# EAGLE design Dyno MCN Breakout (EAGLE 5.12)
PARTNO: 55959-2030
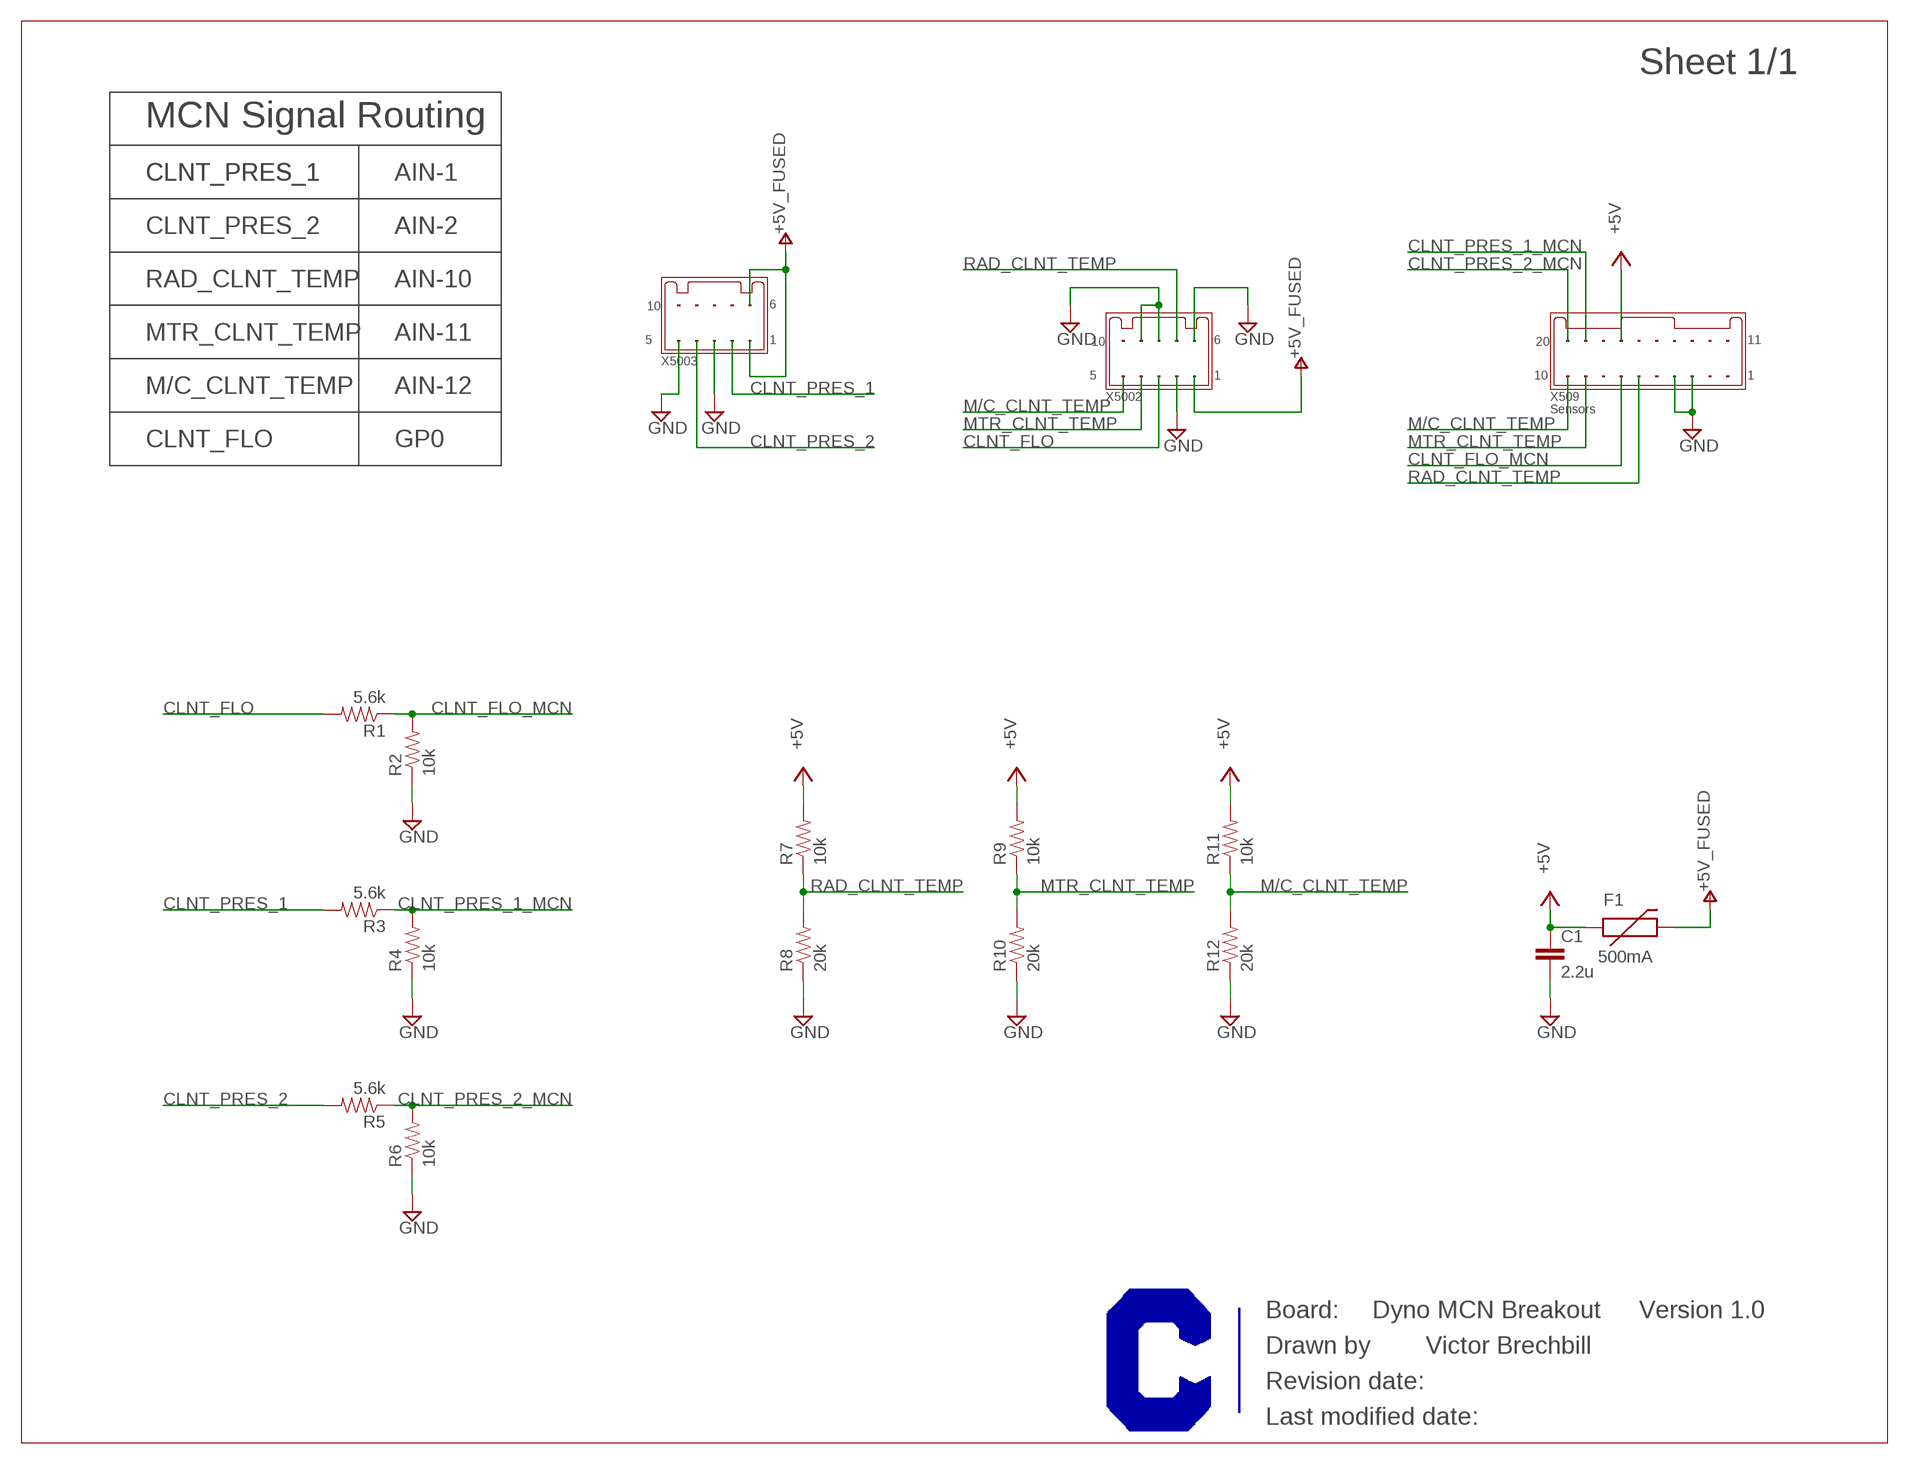
[diagram p0: schematic, sheet 1]

## Parts
C1  2.2u  CAP0603-CAP  [0603-CAP]
F1  500mA  PTC0603  [0603]
R1  5.6k  RESISTOR0603-RES  [0603-RES]
R2  10k  RESISTOR0603-RES  [0603-RES]
R3  5.6k  RESISTOR0603-RES  [0603-RES]
R4  10k  RESISTOR0603-RES  [0603-RES]
R5  5.6k  RESISTOR0603-RES  [0603-RES]
R6  10k  RESISTOR0603-RES  [0603-RES]
R7  10k  RESISTOR0603-RES  [0603-RES]
R8  20k  RESISTOR0603-RES  [0603-RES]
R9  10k  RESISTOR0603-RES  [0603-RES]
R10  20k  RESISTOR0603-RES  [0603-RES]
R11  10k  RESISTOR0603-RES  [0603-RES]
R12  20k  RESISTOR0603-RES  [0603-RES]
U$1  CURRENT-C-LETTER-LANDSCAPE  [BLANK]
X509  Sensors  MICROCLASP-20-DUAL-RA  [MICROCLASP-20-DUAL-RA]
X5002  MICROCLASP-10-DUAL  [MICROCLASP-10-DUAL-RA]
X5003  MICROCLASP-10-DUAL  [MICROCLASP-10-DUAL-RA]

## Nets
+5V: C1.1 F1.1 R7.2 R9.2 R11.2 X509.17
+5V_FUSED: F1.2 X5002.1 X5003.1 X5003.6 ; supply symbol labelled V+
CLNT_FLO: R1.2 X5002.3
CLNT_FLO_MCN: R1.1 R2.2 X509.7
CLNT_PRES_1: R3.2 X5003.2
CLNT_PRES_1_MCN: R3.1 R4.2 X509.19
CLNT_PRES_2: R5.2 X5003.4
CLNT_PRES_2_MCN: R5.1 R6.2 X509.20
GND: C1.2 R2.1 R4.1 R6.1 R8.1 R10.1 R12.1 X509.3 X509.4 X5002.2 X5002.6 X5002.8 X5002.9 X5003.3 X5003.5
M/C_CLNT_TEMP: R11.1 R12.2 X509.10 X5002.5
MTR_CLNT_TEMP: R9.1 R10.2 X509.9 X5002.4
RAD_CLNT_TEMP: R7.1 R8.2 X509.6 X5002.7
Unconnected: X509.1 X509.2 X509.5 X509.8 X509.11 X509.12 X509.13 X509.14 X509.15 X509.16 X509.18 X5002.10 X5003.7 X5003.8 X5003.9 X5003.10

## Notes on the sheet
- MCN Signal Routing
- CLNT_PRES_1 | CLNT_PRES_1 | AIN-1
- CLNT_PRES_2 | AIN-2 | +5V_FUSED
- RAD_CLNT_TEMP | AIN-10
- MTR_CLNT_TEMP | AIN-11
- +5V_FUSED
- M/C_CLNT_TEMP | AIN-12
- CLNT_FLO | GP0
- +5V_FUSED
- Dyno MCN Breakout | Version 1.0
- Victor Brechbill

## Library data of the parts
C1 = SparkFun:CAP: Capacitor Standard 0603 ceramic capacitor, and 0.1" leaded capacitor.
F1 = SparkFun:PTC: Resettable Fuse PTC Resettable Fuse. Spark Fun Electronics SKU : COM-08357
R1-R12 = SparkFun:RESISTOR: Resistor Basic schematic elements and footprints for 0603, 1206, and PTH resistors.
U$1 = Frames:CURRENT-C-LETTER-LANDSCAPE; BOM: EXCLUDE
X509 = Molex:MICROCLASP-20-DUAL
X5002 X5003 = Molex:MICROCLASP-10-DUAL: Microclasp 10 crkt Header Datasheet <http://www.molex.com/pdm_docs/sd/559591030_sd.pdf>; PARTNO: 55959-1030

## Board
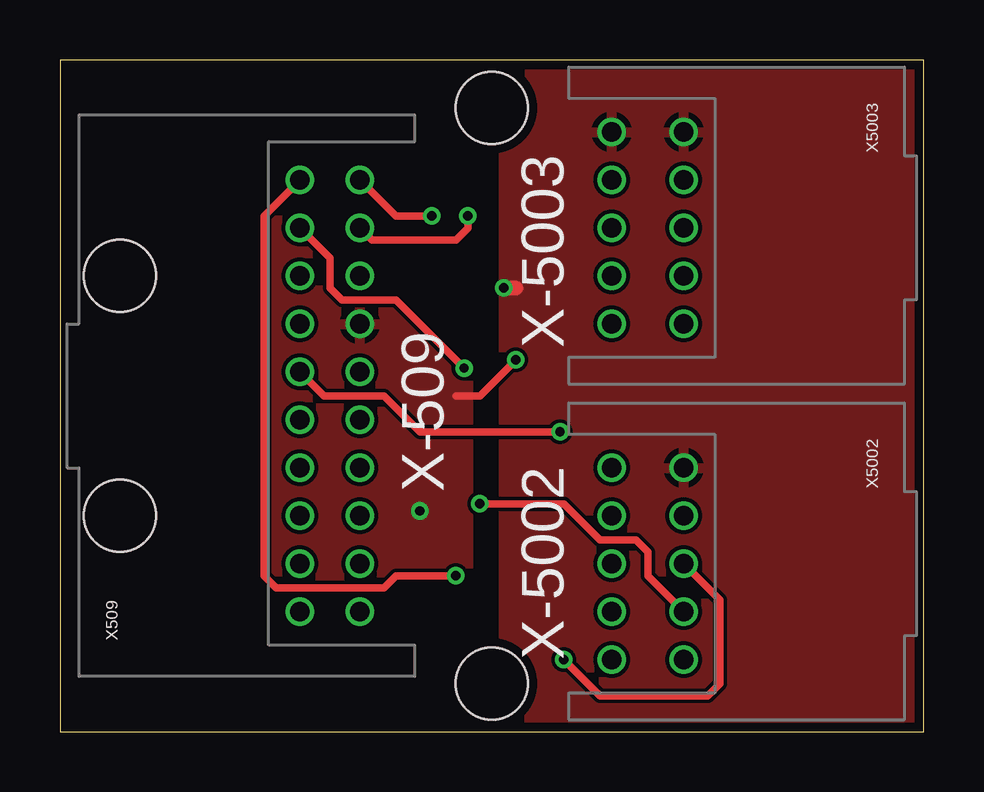
[diagram p1: board, top side]
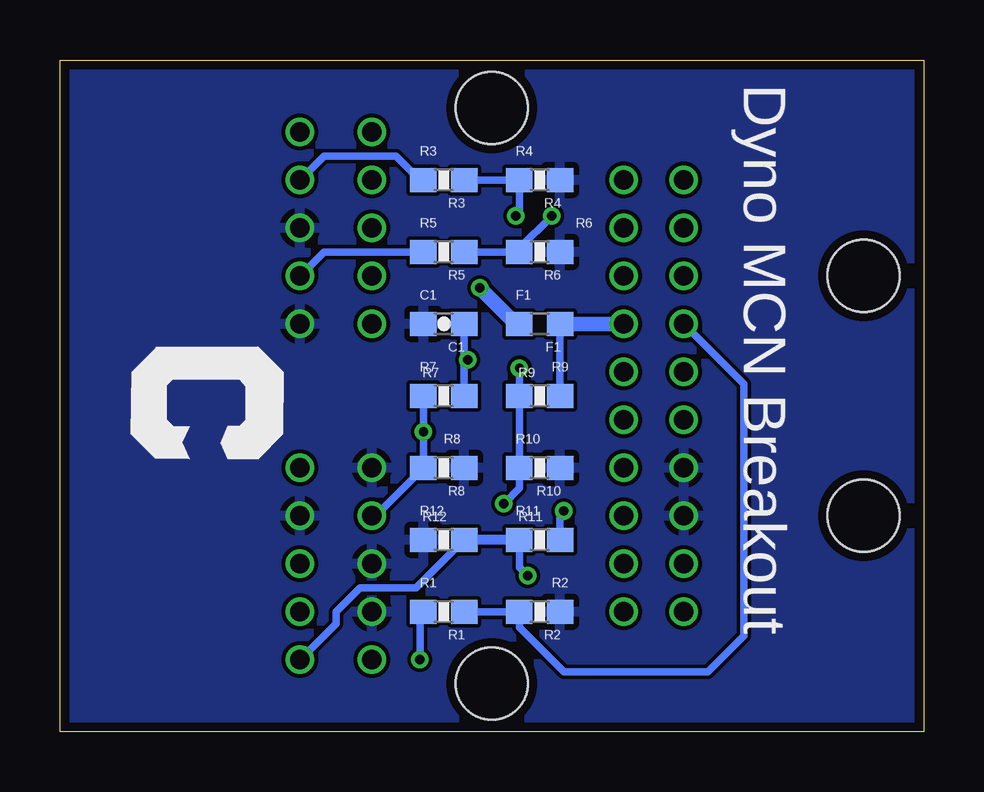
[diagram p2: board, bottom side, seen from below]

Size 36 x 28 mm. Coordinates in mm from the lower left corner, seen from the top.
Outline: 0,0 36,0 36,28 0,28 0,0
Copper layers (1*16): Top 0.0356mm / dielectric 1.5011mm / Bottom 0.0356mm
Design rules "OSH Park 2-layer": minimum track width 6mil, minimum drill 13mil, track to track 6mil, track to pad 6mil, pad to pad 6mil, via to via 6mil, smd to smd 6mil, copper to edge 15mil, drill to drill 6mil, minimum pad ring 7mil, minimum via ring 7mil, stop-mask expansion 4mil, vias tented up to drill 0mil, thermal gap 10mil
Holes 3 mm at 18,2 18,26 2.5,19 2.5,9

### Footprints (pad centres in the part's own frame; a part is rotated, then mirrored left to right if it is on the bottom)
0603-CAP = smd 1.1 x 1: 1 -0.85,0; 2 0.85,0
0603 = smd 1.1 x 1: 1 -0.85,0; 2 0.85,0
0603-RES = smd 1.1 x 1: 1 -0.85,0; 2 0.85,0
MICROCLASP-20-DUAL-RA = drill 0.8 round: 1 -9,0; 2 -7,0; 3 -5,0; 4 -3,0; 5 -1,0; 6 1,0; 7 3,0; 8 5,0; 9 7,0; 10 9,0; 11 -9,-2.5; 12 -7,-2.5; 13 -5,-2.5; 14 -3,-2.5; 15 -1,-2.5; 16 1,-2.5; 17 3,-2.5; 18 5,-2.5; 19 7,-2.5; 20 9,-2.5
MICROCLASP-10-DUAL-RA = drill 0.8 round: 1 -4,0; 2 -2,0; 3 0,0; 4 2,0; 5 4,0; 6 -4,-3; 7 -2,-3; 8 0,-3; 9 2,-3; 10 4,-3

### Placement (x,y rotation side)
C1  20,17 180 bottom
F1  16,17 180 bottom
R1  20,5 180 bottom
R2  16,5 180 bottom
R3  20,23 180 bottom
R4  16,23 180 bottom
R5  20,20 180 bottom
R6  16,20 180 bottom
R7  20,14 0 bottom
R8  20,11 180 bottom
R9  16,14 0 bottom
R10  16,11 180 bottom
R11  16,8 0 bottom
R12  20,8 0 bottom
U$1  -19.05,39.37 0 top  (outside the outline)
X509  10,14 90 top
X5002  26,7 270 top
X5003  26,21 270 top

### Tracks (layer width: path | path; a pad name or v marks a point on that pad's centre or on a via)
+5V  (via drill 0.38)
  Top 0.305: v15,9.2 15,9 | v19,15.5 17.5,14 16.5,14
  Bottom 0.305: R9.2 F1.1 | R7.2 C1.1 19.15,15.65 v19,15.5 | R11.2 15.15,9.05 v15,9.2
  Bottom 0.61: F1.1 X509.17
  pour Top (isolate 0.15, rank 2): 0,28 17,28 17,0 0,0
+5V_FUSED  (via drill 0.38)
  Top 0.61: v18.5,18.5 19,18.5
  Bottom 0.61: F1.2 17,17 v18.5,18.5
  pour Top (isolate 0.15): 18.5,28 36,28 36,0 18.5,0
CLNT_FLO  (via drill 0.38)
  Top 0.305: X5002.3 27.5,5.5 27.5,2 27,1.5 22.5,1.5 v21,3
  Bottom 0.305: v21,3 21,4.85 R1.2
CLNT_FLO_MCN
  Bottom 0.305: R1.1 R2.2 16.85,4.35 15,2.5 9,2.5 7.5,4 7.5,14.5 X509.7
CLNT_PRES_1
  Bottom 0.305: R3.2 21,23 22,24 25,24 X5003.2
CLNT_PRES_1_MCN  (via drill 0.38)
  Top 0.305: v17,21.5 17,21 16.5,20.5 13,20.5 X509.19
  Bottom 0.305: R3.1 R4.2 16.85,21.65 v17,21.5
CLNT_PRES_2
  Bottom 0.305: R5.2 25,20 X5003.4
CLNT_PRES_2_MCN  (via drill 0.38)
  Top 0.305: v15.5,21.5 14,21.5 X509.20
  Bottom 0.305: R5.1 R6.2 16.85,20.15 v15.5,21.5
GND
  pour Bottom (isolate 0.15): 0,28 36,28 36,0 0,0
M/C_CLNT_TEMP  (via drill 0.38)
  Top 0.305: v16.5,6.5 14,6.5 13.5,6 9,6 8.5,6.5 8.5,21.5 X509.10
  Bottom 0.305: R12.2 21.15,6 23.5,6 24.5,5 24.5,4.5 X5002.5 | R11.1 16.85,6.85 v16.5,6.5
  Bottom 0.406: R11.1 R12.2
MTR_CLNT_TEMP  (via drill 0.38)
  Top 0.305: v16.85,15.15 14,18 11.75,18 11.25,18.5 11.25,19.75 X509.9 | X5002.4 24.5,6.5 24.5,7.5 24,8 22.5,8 21,9.5 v17.5,9.5
  Bottom 0.305: v16.85,15.15 R9.1 R10.2 16.85,10.15 v17.5,9.5
RAD_CLNT_TEMP  (via drill 0.38)
  Top 0.305: v20.85,12.5 15,12.5 13.5,14 11,14 X509.6
  Bottom 0.305: X5002.7 22.85,9 R8.2 v20.85,12.5 R7.1

### Text on the board
_tsilk: X-5003 | X-509 | X-5002
_bsilk: Dyno MCN Breakout | R4 | R3 | R6 | R5 | F1 | C1 | R9 | R7 | R10 | R8 | R11 | R12 | R2 | R1